# Altium project AMC_FMC_Carrier v4.PrjPcb (part 11 of 17)

## Sheet UI_mon.SchDoc: AMC FMC Carrier v4.0.5
size A4; CompanyName: WUT; Organization: WUT ISE; Address1: Warsaw University of Technology; Address2: Nowowiejska 15/19 00-665 Warsaw; Address3: t.przywozki@gmail.com; Revision: 1; SheetNumber: 16; SheetTotal: 29; Project: AMC FMC Carrier v4.0.5; ModifiedBy: F. Świtakowski; CreateDate: XX/XX/XXXX; CheckedDate: -; Title2: Power Measurement; DivGrp: ISE; Designer: T. Przywozki; ModifiedDate: -; ProjectName: ADC/DAC MEZZANINE
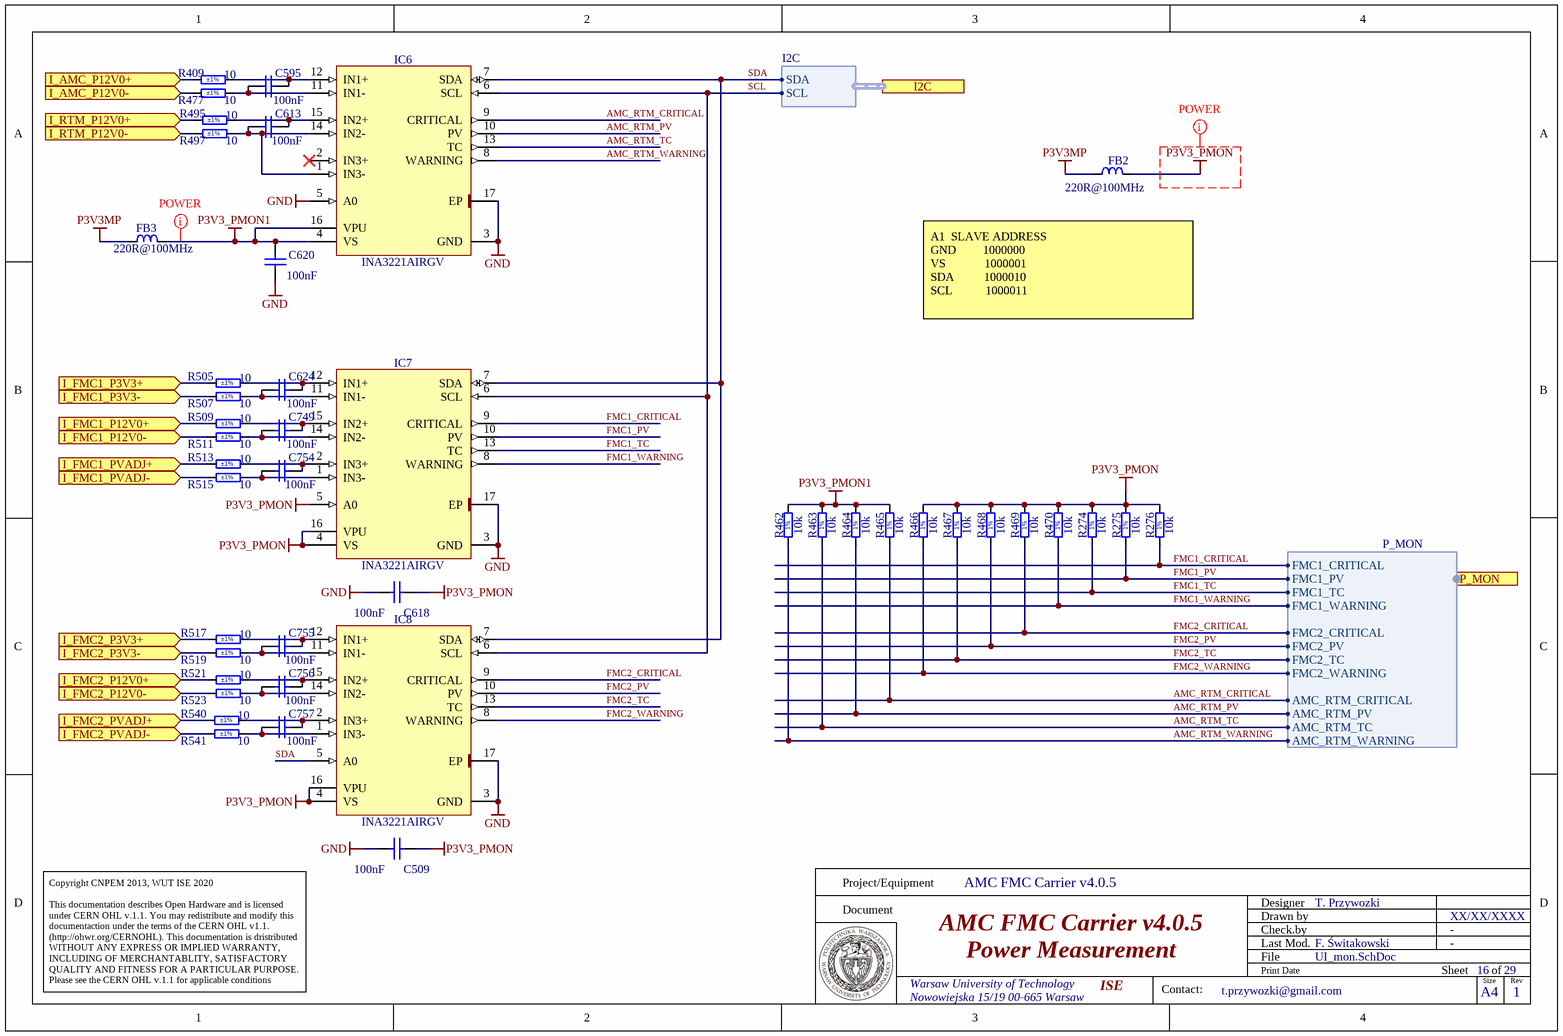
[diagram p19: UI_mon.SchDoc]

### Parts
C509  100nF  [CAPC0603X33N]
C595  100nF  [CAPC0603X33N]
C613  100nF  [CAPC0603X33N]
C618  100nF  [CAPC0603X33N]
C620  100nF  [CAPC0603X33N]
C624  100nF  [CAPC0603X33N]
C749  100nF  [CAPC0603X33N]
C754  100nF  [CAPC0603X33N]
C755  100nF  [CAPC0603X33N]
C756  100nF  [CAPC0603X33N]
C757  100nF  [CAPC0603X33N]
FB2  220R@100MHz  [INDC2012X105N]
FB3  220R@100MHz  [INDC2012X105N]
IC6  INA3221AIRGV  [QFN65P400X400X100-17N-S225]
IC7  INA3221AIRGV  [QFN65P400X400X100-17N-S225]
IC8  INA3221AIRGV  [QFN65P400X400X100-17N-S225]
R274  10k  [RESC1005X40N]
R275  10k  [RESC1005X40N]
R276  10k  [RESC1005X40N]
R409  10  Tolerance: ±1%  [RESC1005X40N]
R462  10k  [RESC1005X40N]
R463  10k  [RESC1005X40N]
R464  10k  [RESC1005X40N]
R465  10k  [RESC1005X40N]
R466  10k  [RESC1005X40N]
R467  10k  [RESC1005X40N]
R468  10k  [RESC1005X40N]
R469  10k  [RESC1005X40N]
R470  10k  [RESC1005X40N]
R477  10  Tolerance: ±1%  [RESC1005X40N]
R495  10  Tolerance: ±1%  [RESC1005X40N]
R497  10  Tolerance: ±1%  [RESC1005X40N]
R505  10  Tolerance: ±1%  [RESC1005X40N]
R507  10  Tolerance: ±1%  [RESC1005X40N]
R509  10  Tolerance: ±1%  [RESC1005X40N]
R511  10  Tolerance: ±1%  [RESC1005X40N]
R513  10  Tolerance: ±1%  [RESC1005X40N]
R515  10  Tolerance: ±1%  [RESC1005X40N]
R517  10  Tolerance: ±1%  [RESC1005X40N]
R519  10  Tolerance: ±1%  [RESC1005X40N]
R521  10  Tolerance: ±1%  [RESC1005X40N]
R523  10  Tolerance: ±1%  [RESC1005X40N]
R540  10  Tolerance: ±1%  [RESC1005X40N]
R541  10  Tolerance: ±1%  [RESC1005X40N]

### Ports
I2C (harness I2C), I_AMC_P12V0+ (in), I_AMC_P12V0- (in), I_FMC1_P3V3+ (in), I_FMC1_P3V3- (in), I_FMC1_P12V0+ (in), I_FMC1_P12V0- (in), I_FMC1_PVADJ+ (in), I_FMC1_PVADJ- (in), I_FMC2_P3V3+ (in), I_FMC2_P3V3- (in), I_FMC2_P12V0+ (in), I_FMC2_P12V0- (in), I_FMC2_PVADJ+ (in), I_FMC2_PVADJ- (in), I_RTM_P12V0+ (in), I_RTM_P12V0- (in), P_MON (harness P_MON)

### Harnesses
I2C: SCL, SDA
P_MON: FMC1_CRITICAL, FMC1_TC, FMC1_WARNING, AMC_RTM_CRITICAL, FMC2_WARNING, AMC_RTM_PV, FMC2_CRITICAL, AMC_RTM_TC, FMC2_PV, AMC_RTM_WARNING, FMC2_TC, FMC1_PV

### Nets
GND: C509.2 C618.2 C620.2 IC6.3(GND) IC6.5(A0) IC6.17(EP) IC7.3(GND) IC7.17(EP) IC8.3(GND) IC8.17(EP)
P3V3_PMON: C509.1 C618.1 FB2.2 IC7.4(VS) IC7.5(A0) IC7.16(VPU) IC8.4(VS) IC8.16(VPU) R274.2 R275.2 R276.2 R466.2 R467.2 R468.2 R469.2 R470.2
P3V3_PMON1: C620.1 FB3.2 IC6.4(VS) IC6.16(VPU) R462.2 R463.2 R464.2 R465.2
P3V3MP: FB2.1 FB3.1
AMC_RTM_CRITICAL: IC6.9(CRITICAL) R465.1 ; port P_MON.AMC_RTM_CRITICAL
AMC_RTM_PV: IC6.10(PV) R464.1 ; port P_MON.AMC_RTM_PV
AMC_RTM_TC: IC6.13(TC) R463.1 ; port P_MON.AMC_RTM_TC
AMC_RTM_WARNING: IC6.8(WARNING) R462.1 ; port P_MON.AMC_RTM_WARNING
FMC1_CRITICAL: IC7.9(CRITICAL) R276.1 ; port P_MON.FMC1_CRITICAL
FMC1_PV: IC7.10(PV) R275.1 ; port P_MON.FMC1_PV
FMC1_TC: IC7.13(TC) R274.1 ; port P_MON.FMC1_TC
FMC1_WARNING: IC7.8(WARNING) R470.1 ; port P_MON.FMC1_WARNING
FMC2_CRITICAL: IC8.9(CRITICAL) R469.1 ; port P_MON.FMC2_CRITICAL
FMC2_PV: IC8.10(PV) R468.1 ; port P_MON.FMC2_PV
FMC2_TC: IC8.13(TC) R467.1 ; port P_MON.FMC2_TC
FMC2_WARNING: IC8.8(WARNING) R466.1 ; port P_MON.FMC2_WARNING
I_AMC_P12V0+: R409.1 ; port I_AMC_P12V0+
I_AMC_P12V0-: R477.1 ; port I_AMC_P12V0-
I_FMC1_P3V3n: R507.1 ; port I_FMC1_P3V3-
I_FMC1_P3V3p: R505.1 ; port I_FMC1_P3V3+
I_FMC1_P12V0+: R509.1 ; port I_FMC1_P12V0+
I_FMC1_P12V0-: R511.1 ; port I_FMC1_P12V0-
I_FMC1_PADJn: R515.1 ; port I_FMC1_PVADJ-
I_FMC1_PADJp: R513.1 ; port I_FMC1_PVADJ+
I_FMC2_P3V3n: R519.1 ; port I_FMC2_P3V3-
I_FMC2_P3V3p: R517.1 ; port I_FMC2_P3V3+
I_FMC2_P12V0+: R521.1 ; port I_FMC2_P12V0+
I_FMC2_P12V0-: R523.1 ; port I_FMC2_P12V0-
I_FMC2_PADJn: R541.1 ; port I_FMC2_PVADJ-
I_FMC2_PADJp: R540.1 ; port I_FMC2_PVADJ+
I_RTM_P12V0+: R495.1 ; port I_RTM_P12V0+
I_RTM_P12V0-: R497.1 ; port I_RTM_P12V0-
SCL: IC6.6(SCL) IC7.6(SCL) IC8.6(SCL) ; port I2C.SCL  [project net PM_I2C.SCL]
SDA: IC6.7(SDA) IC7.7(SDA) IC8.5(A0) IC8.7(SDA) ; port I2C.SDA  [project net PM_I2C.SDA]
NetC595_1: C595.1 IC6.11(IN1-) R477.2
NetC595_2: C595.2 IC6.12(IN1+) R409.2
NetC613_1: C613.1 IC6.1(IN3-) IC6.14(IN2-) R497.2
NetC613_2: C613.2 IC6.15(IN2+) R495.2
NetC624_1: C624.1 IC7.11(IN1-) R507.2
NetC624_2: C624.2 IC7.12(IN1+) R505.2
NetC749_1: C749.1 IC7.14(IN2-) R511.2
NetC749_2: C749.2 IC7.15(IN2+) R509.2
NetC754_1: C754.1 IC7.1(IN3-) R515.2
NetC754_2: C754.2 IC7.2(IN3+) R513.2
NetC755_1: C755.1 IC8.11(IN1-) R519.2
NetC755_2: C755.2 IC8.12(IN1+) R517.2
NetC756_1: C756.1 IC8.14(IN2-) R523.2
NetC756_2: C756.2 IC8.15(IN2+) R521.2
NetC757_1: C757.1 IC8.1(IN3-) R541.2
NetC757_2: C757.2 IC8.2(IN3+) R540.2

Not connected (* = marked no-connect by the designer): IC6 2(IN3+)*

### Layout directives
net class POWER: P3V3_PMON, P3V3_PMON1

### Notes on the sheet
- (near FB2) A1 	SLAVE ADDRESS
  GND         1000000
  VS             1000001
  SDA          1000010
  SCL           1000011
- Project/Equipment
- Document
- Designer
- Drawn by
- Check.by
- Copyright CNPEM 2013, WUT ISE 2020
  This documentation describes Open Hardware and is licensed under CERN OHL v.1.1. You may redistribute and modify this documentaction under the terms of the CERN OHL v1.1.
  (http://ohwr.org/CERNOHL). This documentation is dristributed WITHOUT ANY EXPRESS OR IMPLIED WARRANTY, INCLUDING OF MERCHANTABLITY, SATISFACTORY QUALITY AND FITNESS FOR A PARTICULAR PURPOSE. Please see the CERN OHL v.1.1 for applicable conditions
- File
- Last Mod.
- Print Date
- Sheet
- Size
- A4
- of
- Rev
- Contact:
- (in symbol R0402_10K_1%_0.0625W_100PPM) 1%

### Library data of the parts
C509 C618 C620 = CC0201_100NF_6.3V_10%_X5R: Non-polarised capacitor; Part Description: SMD Multilayer Chip Ceramic Capacitor; Manufacturer: GENERIC; Manufacturer1 Part Number: 02016D104KAT2A; Voltage: 6.3V; TC: X5R; Tolerance: ±10%; Table: Capacitors SMD; Part Number: CC0201_100NF_6.3V_10%_X5R; Component Kind: Standard; Component Type: Standard; Pin Count: 2; Value: 100nF; Status: Not Recommended; Manufacturer Part Number: CC0201_100NF_6.3V_10%_X5R; Case: 0201; Mounted: Yes; Socket: No; SMD: Yes; Manufacturer1 Example: AVX; Manufacturer1 ComponentHeight: 0.33mm; HelpURL: \\cern.ch\dfs\Applications\Altium\Datasheets\CC0201_X5R_AVX.pdf; Author: CERN DEM JLC; CreateDate: 2007-12-03; LatestRevisionDate: 2007-12-03
C595 C613 C624 C749 C754-C757 = CC0201_100NF_6.3V_10%_X5R: Non-polarised capacitor; Part Description: SMD Multilayer Chip Ceramic Capacitor; Manufacturer: GENERIC; Manufacturer1 Part Number: 02016D104KAT2A; Voltage: 6.3V; TC: X5R; Tolerance: ±10%; Part Number: CC0201_100NF_6.3V_10%_X5R; Component Kind: Standard; Component Type: Standard; Pin Count: 2; Value: 100nF; Status: Not Recommended; Manufacturer Part Number: CC0201_100NF_6.3V_10%_X5R; Case: 0201; Mounted: Yes; Socket: No; SMD: Yes; Sense: No; Manufacturer1 Example: AVX; Manufacturer1 ComponentHeight: 0.33mm; HelpURL: \\cern.ch\dfs\Applications\Altium\Datasheets\CC0201_X5R_AVX.pdf; Author: CERN DEM JLC; CreateDate: 03.12.2007; LatestRevisionDate: 03.12.2007
FB2 FB3 = IND0805_MURATA_BLM21PG221SN1D: Inductor; Part Description: SMD EMIFIL Suppression Chip Bead Ferrite; Manufacturer: MURATA; Power: 2A; Resistance: 0.05R; Tolerance: ±25%; Table: Inductors SMD; Part Number: IND0805_MURATA_BLM21PG221SN1D; Component Kind: Standard; Component Type: Standard; Pin Count: 2; Value: 220R@100MHz; Status: None; Manufacturer Part Number: BLM21PG221SN1D; Case: 0805; Mounted: Yes; Socket: No; SMD: Yes; ComponentHeight: 1.05mm; HelpURL: \\cern.ch\dfs\Applications\Altium\Datasheets\IND0402_MURATA_BLM21P.pdf; Author: CERN DEM JLC; CreateDate: 25/01/2010; LatestRevisionDate: 25/01/2010
IC6-IC8 = INA3221AIRGV: Triple-Channel, High-Side Measurement, Shunt and Bus Voltage Monitor With I2C and SMBUS-Compatible Interface; Manufacturer: TEXAS INSTRUMENTS; PressFit: No; Bonding: No; Part Number: INA3221AIRGV; Component Kind: Standard; Component Type: Standard; Device: INA3221AIRGV; PackageDescription: QFN, 0.65mm Pitch, Square; 16 Pin, 4.00mm L X 4.00mm W X 1.00mm H body (w/Thermal Tab 2.25 X 2.25mm), IPC Medium Density; Part Description: Triple-Channel, High-Side Measurement, Shunt and Bus Voltage Monitor With I2C and SMBUS-Compatible Interface; Manufacturer Part Number: INA3221AIRGV; Pin Count: 17; Case: QFN16; Mounted: Yes; Socket: No; SMD: Yes; Sense: No; ComponentHeight: 1mm; Author: CERN DEM MR; HelpURL: \\cern.ch\dfs\Applications\Altium\Datasheets\INA3221AIRGV.pdf; CreateDate: 01.12.2016; LatestRevisionDate: 01.12.2016
R274-R276 R462-R470 = R0402_10K_1%_0.0625W_100PPM: Resistor - 1%; Manufacturer: GENERIC; Part Description: General Purpose Thick Film Chip Resistor; Manufacturer1 Part Number: 232270671003L; TC: ±100ppm/°C; PressFit: No; Manufacturer Part Number: R0402_10K_1%_0.0625W_100PPM; Part Number: R0402_10K_1%_0.0625W_100PPM; Tolerance: ±1%; Value: 10k; Component Kind: Standard; Component Type: Standard; Pin Count: 2; Status: Not Recommended; Power: 0.0625W; Case: 0402; Mounted: Yes; Sense: No; Socket: No; SMD: Yes; Manufacturer1 Example: YAGEO PHYCOMP; Manufacturer1 ComponentHeight: 0.4mm; HelpURL: \\cern.ch\dfs\Applications\Altium\Datasheets\R0402_Phycomp_RC0402.pdf; Author: CERN DEM JLC; CreateDate: 03.12.2007; LatestRevisionDate: 17.10.2012
R409 R477 R495 R497 R505 R507 R509 R511 R513 R515 R517 R519 R521 R523 R540 R541 = R0402_10R_1%_0.0625W_200PPM: Resistor - 1%; Part Description: General Purpose Thick Film Chip Resistor; Manufacturer: GENERIC; Manufacturer1 Part Number: 232270671009L; TC: ±200ppm/°C; PressFit: No; Part Number: R0402_10R_1%_0.0625W_200PPM; Component Kind: Standard; Component Type: Standard; Pin Count: 2; Value: 10; Status: Not Recommended; Power: 0.0625W; Manufacturer Part Number: R0402_10R_1%_0.0625W_200PPM; Case: 0402; Mounted: Yes; Sense: No; Socket: No; SMD: Yes; Manufacturer1 Example: YAGEO PHYCOMP; Manufacturer1 ComponentHeight: 0.4mm; HelpURL: \\cern.ch\dfs\Applications\Altium\Datasheets\R0402_Phycomp_RC0402.pdf; Author: CERN DEM JLC; CreateDate: 24.06.2009; LatestRevisionDate: 17.10.2012

## Sheet JTAG_Configuration.SchDoc: AMC FMC Carrier v4
size 420 x 297 mm; CompanyName: WUT; Organization: WUT ISE; Address1: Warsaw University of Technology; Address2: Nowowiejska 15/19 00-665 Warsaw; Address3: t.przywozki@gmail.com; Revision: 1; SheetNumber: 9; SheetTotal: 29; Project: AMC FMC Carrier v4.0.2; ModifiedBy: F. Świtakowski; CheckedDate: -; Title2: JTAG Chain; DivGrp: ISE; Designer: T. Przywozki; ModifiedDate: -; ProjectName: ADC/DAC MEZZANINE
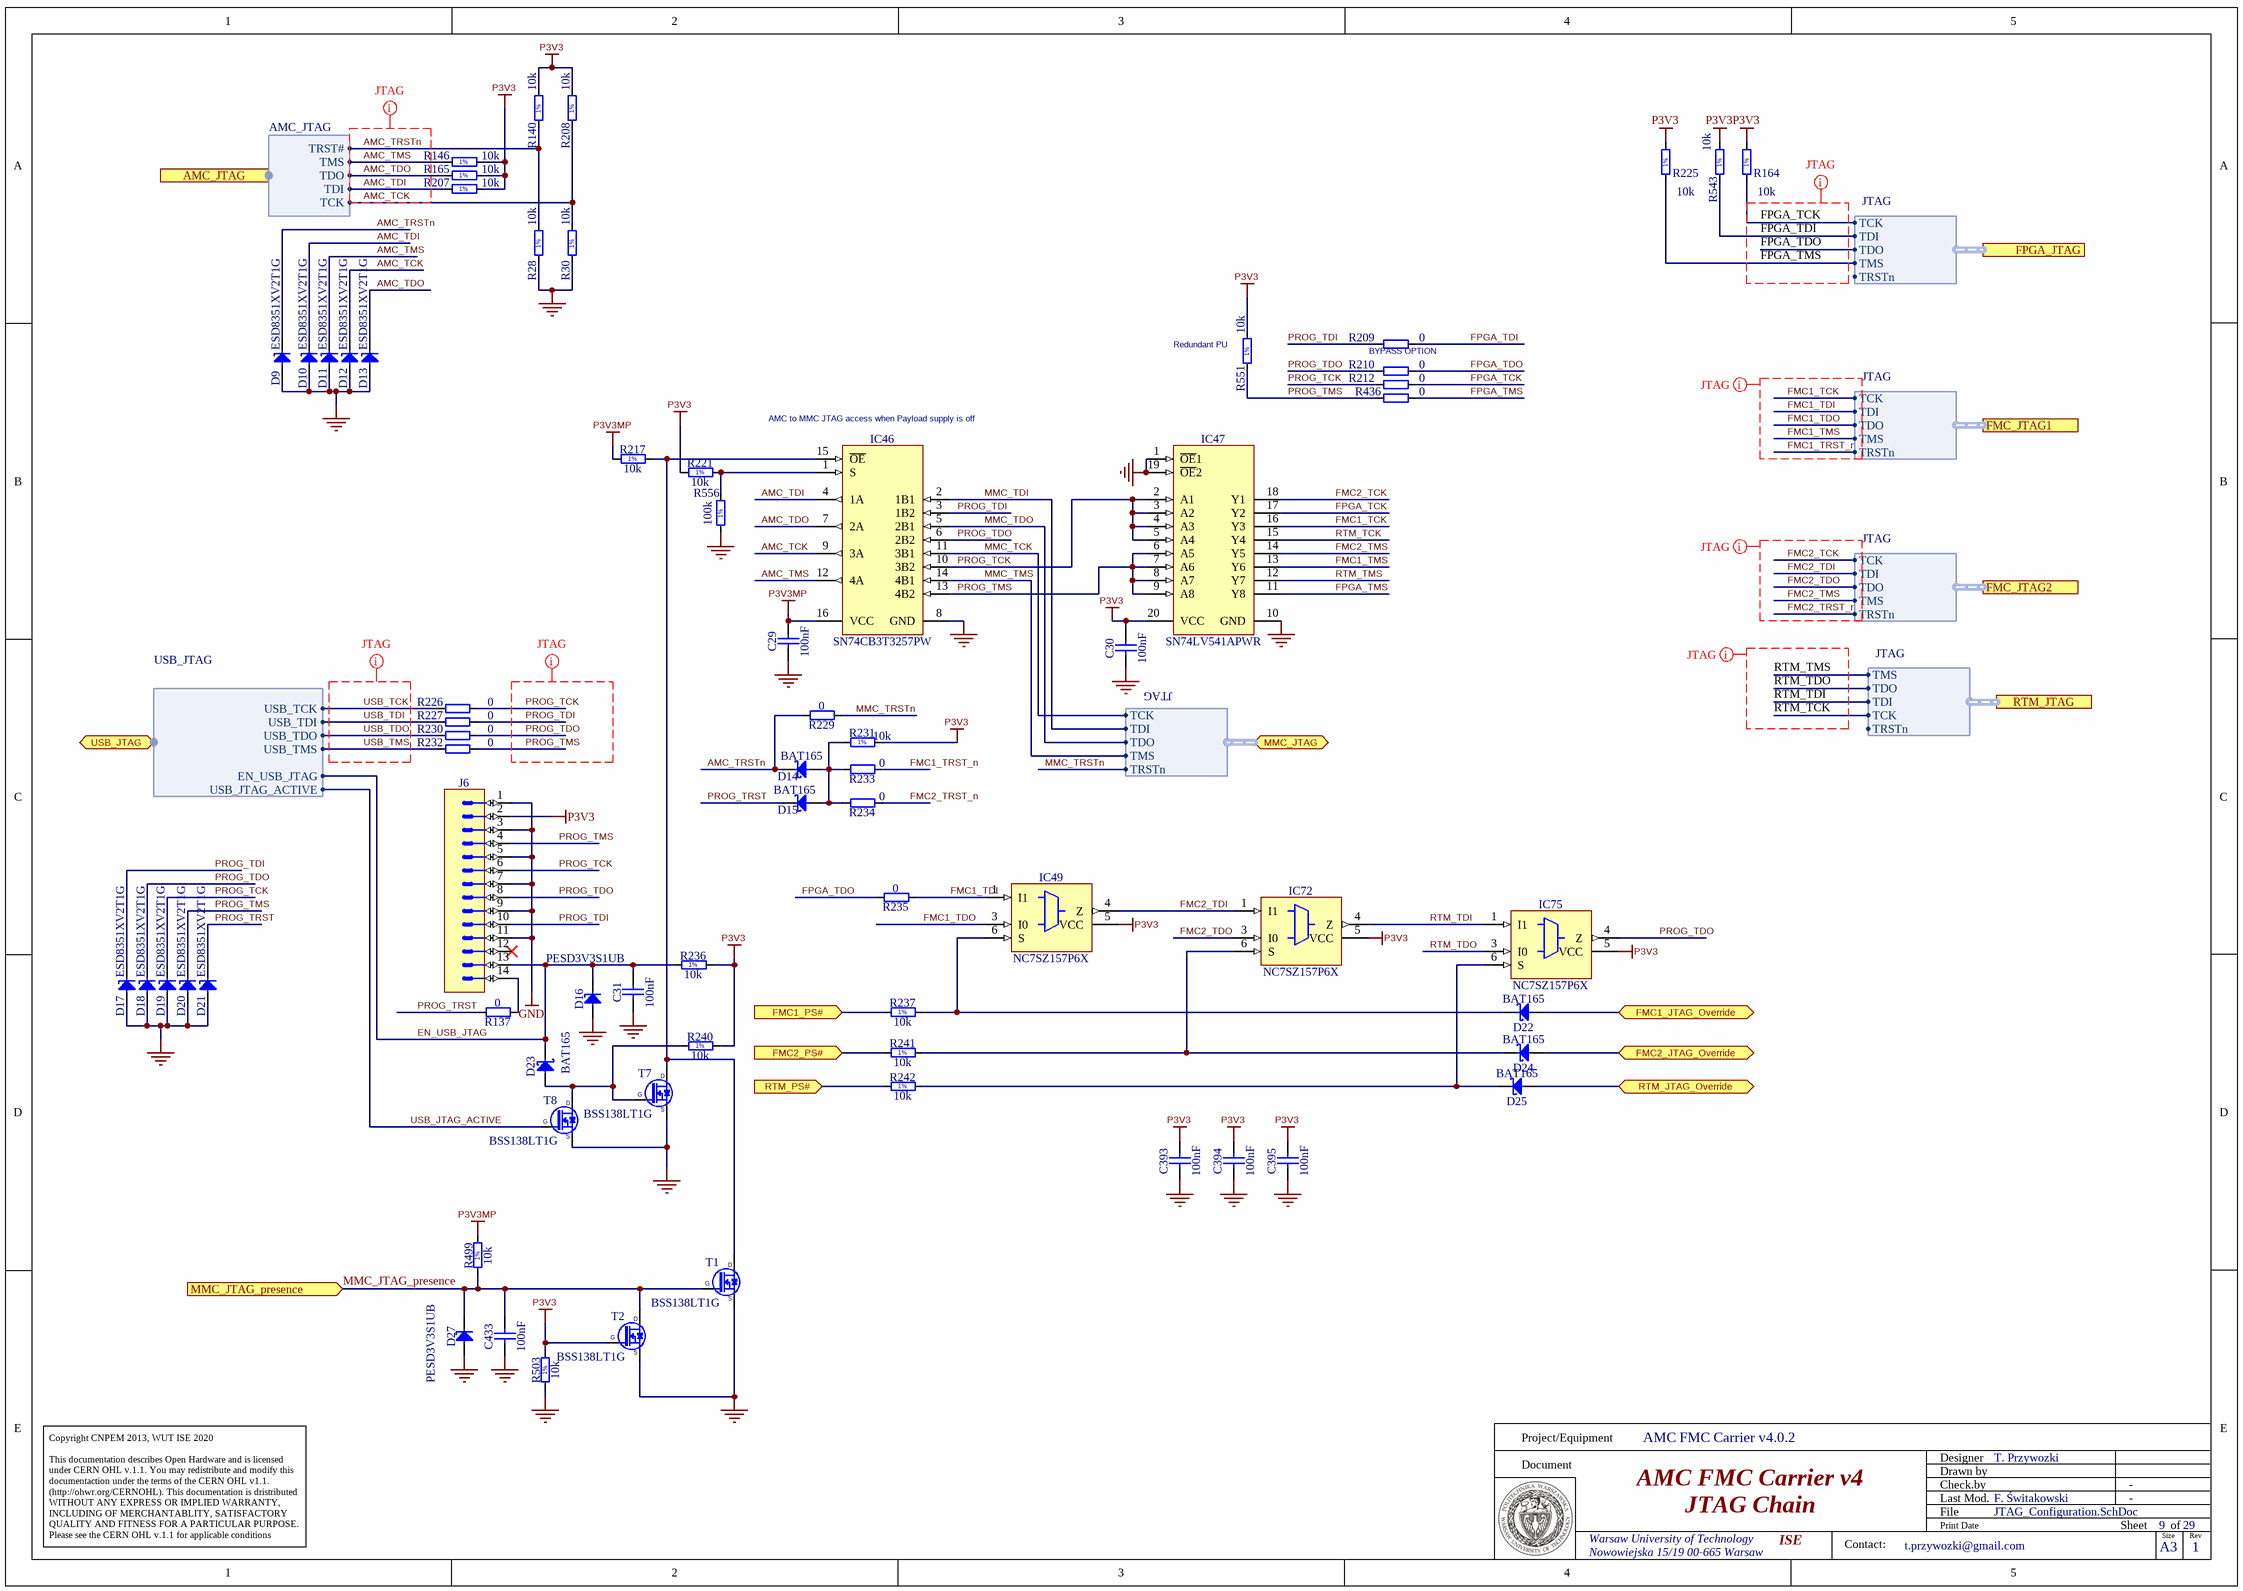
[diagram p20: JTAG_Configuration.SchDoc]

### Parts
C29  100nF  [CAPC0603X33N]
C30  100nF  [CAPC0603X33N]
C31  100nF  [CAPC1005X55N]
C393  100nF  [CAPC0603X33N]
C394  100nF  [CAPC0603X33N]
C395  100nF  [CAPC0603X33N]
C433  100nF  [CAPC1005X55N]
D9  ESD8351XV2T1G  [SODFL1608X65N]
D10  ESD8351XV2T1G  [SODFL1608X65N]
D11  ESD8351XV2T1G  [SODFL1608X65N]
D12  ESD8351XV2T1G  [SODFL1608X65N]
D13  ESD8351XV2T1G  [SODFL1608X65N]
D14  BAT165  [SOD2512X110N]
D15  BAT165  [SOD2512X110N]
D16  PESD3V3S1UB  [SODFL1608X65N]
D17  ESD8351XV2T1G  [SODFL1608X65N]
D18  ESD8351XV2T1G  [SODFL1608X65N]
D19  ESD8351XV2T1G  [SODFL1608X65N]
D20  ESD8351XV2T1G  [SODFL1608X65N]
D21  ESD8351XV2T1G  [SODFL1608X65N]
D22  BAT165  [SOD2512X110N]
D23  BAT165  [SOD2512X110N]
D24  BAT165  [SOD2512X110N]
D25  BAT165  [SOD2512X110N]
D27  PESD3V3S1UB  [SODFL1608X65N]
IC46  SN74CB3T3257PW  [SOP65P640X120-16N]
IC47  SN74LV541APWR  [SOP65P640X120-20N]
IC49  NC7SZ157P6X  [SOT65P210X110-6N]
IC72  NC7SZ157P6X  [SOT65P210X110-6N]
IC75  NC7SZ157P6X  [SOT65P210X110-6N]
J6  Milli-Grid™  [MOLEX_87832-1420]  (value not drawn)
R28  10k  [RESC1005X40N]
R30  10k  [RESC1005X40N]
R137  0  [RESC1005X40N]
R140  10k  [RESC1005X40N]
R146  10k  [RESC1005X40N]
R164  10k  [RESC1005X40N]
R165  10k  [RESC1005X40N]
R207  10k  [RESC1005X40N]
R208  10k  [RESC1005X40N]
R209  0  [RESC1005X40N]
R210  0  [RESC1005X40N]
R212  0  [RESC1005X40N]
R217  10k  [RESC1005X40N]
R221  10k  [RESC1005X40N]
R225  10k  [RESC1005X40N]
R226  0  [RESC1005X40N]
R227  0  [RESC1005X40N]
R229  0  [RESC1005X40N]
R230  0  [RESC1005X40N]
R231  10k  [RESC1005X40N]
R232  0  [RESC1005X40N]
R233  0  [RESC1005X40N]
R234  0  [RESC1005X40N]
R235  0  [RESC1005X40N]
R236  10k  [RESC1005X40N]
R237  10k  [RESC1005X40N]
R240  10k  [RESC1005X40N]
R241  10k  [RESC1005X40N]
R242  10k  [RESC1005X40N]
R436  0  [RESC1005X40N]
R499  10k  [RESC1005X40N]
R503  10k  [RESC1005X40N]
R543  10k  [RESC1005X40N]
R551  10k  [RESC1005X40N]
R556  100k  [RESC1005X40N]
T1  BSS138LT1G  [SOT95P240X110-3N]
T2  BSS138LT1G  [SOT95P240X110-3N]
T7  BSS138LT1G  [SOT95P240X110-3N]
T8  BSS138LT1G  [SOT95P240X110-3N]

### Ports
AMC_JTAG (harness AMC_JTAG), FMC1_JTAG_Override (bidir), FMC1_PS# (in), FMC2_JTAG_Override (bidir), FMC2_PS# (in), FMC_JTAG1 (harness JTAG), FMC_JTAG2 (harness JTAG), FPGA_JTAG (harness JTAG), MMC_JTAG (bidir, harness JTAG), MMC_JTAG_presence (in), RTM_JTAG (harness JTAG), RTM_JTAG_Override (bidir), RTM_PS# (in), USB_JTAG (bidir, harness USB_JTAG)

### Harnesses
AMC_JTAG: TCK, TDI, TDO, TMS, TRST#
USB_JTAG: USB_TDI, USB_TCK, USB_TMS, USB_TDO, USB_JTAG_ACTIVE, EN_USB_JTAG
JTAG: TCK, TDI, TDO, TMS, TRSTn

### Nets
GND: C29.1 C30.1 C31.1 C393.1 C394.1 C395.1 C433.1 D9.2(A) D10.2(A) D11.2(A) D12.2(A) D13.2(A) D16.2(A) D17.2(A) D18.2(A) D19.2(A) D20.2(A) D21.2(A) D27.2(A) IC46.8(GND) IC47.1(~{OE}1) IC47.10(GND) IC47.19(~{OE}2) IC49.2(GND) IC72.2(GND) IC75.2(GND) J6.1 J6.3 J6.5 J6.7 J6.9 J6.11 R28.2 R30.2 R503.1 R556.1 T1.2(S) T2.2(S) T7.2(S) T8.2(S)
P3V3: C30.2 C393.2 C394.2 C395.2 IC47.20(VCC) IC49.5(VCC) IC72.5(VCC) IC75.5(VCC) J6.2 R140.1 R146.1 R164.2 R165.1 R207.1 R208.1 R221.2 R225.2 R231.1 R236.2 R240.2 R503.2 R543.1 R551.1 T2.1(G)
P3V3MP: C29.2 IC46.16(VCC) R217.2 R499.2
AMC_TCK: D12.1(C) IC46.9(3A) R30.1 R208.2 ; port AMC_JTAG.TCK  [project net AJTAG.TCK]
AMC_TDI: D10.1(C) IC46.4(1A) R207.2 ; port AMC_JTAG.TDI  [project net AJTAG.TDI]
AMC_TDO: D13.1(C) IC46.7(2A) R165.2 ; port AMC_JTAG.TDO  [project net AJTAG.TDO]
AMC_TMS: D11.1(C) IC46.12(4A) R146.2 ; port AMC_JTAG.TMS  [project net AJTAG.TMS]
AMC_TRSTn: D9.1(C) D14.1(C) R28.1 R140.2 R229.2 ; port AMC_JTAG.TRST#  [project net AJTAG.TRST#]
EN_USB_JTAG: C31.2 D16.1(C) D23.1(C) J6.13 R236.1 ; port USB_JTAG.EN_USB_JTAG
FMC1_JTAG_Override: D22.2(A) ; port FMC1_JTAG_Override
FMC1_TCK: IC47.16(Y3) ; port FMC_JTAG1.TCK  [project net JTAG1.TCK]
FMC1_TDI: IC49.1(I1) R235.1 ; port FMC_JTAG1.TDI  [project net JTAG1.TDI]
FMC1_TDO: IC49.3(I0) ; port FMC_JTAG1.TDO  [project net JTAG1.TDO]
FMC1_TMS: IC47.13(Y6) ; port FMC_JTAG1.TMS  [project net JTAG1.TMS]
FMC1_TRST_n: R233.1 ; port FMC_JTAG1.TRSTn  [project net JTAG1.TRSTn]
FMC2_JTAG_Override: D24.2(A) ; port FMC2_JTAG_Override
FMC2_TCK: IC47.18(Y1) ; port FMC_JTAG2.TCK  [project net JTAG2.TCK]
FMC2_TDI: IC49.4(Z) IC72.1(I1) ; port FMC_JTAG2.TDI  [project net JTAG2.TDI]
FMC2_TDO: IC72.3(I0) ; port FMC_JTAG2.TDO  [project net JTAG2.TDO]
FMC2_TMS: IC47.14(Y5) ; port FMC_JTAG2.TMS  [project net JTAG2.TMS]
FMC2_TRST_n: R234.1 ; port FMC_JTAG2.TRSTn  [project net JTAG2.TRSTn]
FMC_PRSNT.FMC1_PRSNT_M2C_L: R237.2 ; port FMC1_PS#
FMC_PRSNT.FMC2_PRSNT_M2C_L: R241.2 ; port FMC2_PS#
FPGA_TCK: IC47.17(Y2) R164.1 R212.1 ; port FPGA_JTAG.TCK  [project net FJTAG.TCK]
FPGA_TDI: R209.1 R543.2 ; port FPGA_JTAG.TDI  [project net FJTAG.TDI]
FPGA_TDO: R210.1 R235.2 ; port FPGA_JTAG.TDO  [project net FJTAG.TDO]
FPGA_TMS: IC47.11(Y8) R225.1 R436.1 ; port FPGA_JTAG.TMS  [project net FJTAG.TMS]
MMC_JTAG_presence: C433.2 D27.1(C) R499.1 T1.1(G) T2.3(D) ; port MMC_JTAG_presence
MMC_TCK: IC46.11(3B1) ; port MMC_JTAG.TCK
MMC_TDI: IC46.2(1B1) ; port MMC_JTAG.TDI
MMC_TDO: IC46.5(2B1) ; port MMC_JTAG.TDO
MMC_TMS: IC46.14(4B1) ; port MMC_JTAG.TMS
MMC_TRSTn: R229.1 ; port MMC_JTAG.TRSTn
PROG_TCK: D19.1(C) IC46.10(3B2) IC47.2(A1) IC47.3(A2) IC47.4(A3) IC47.5(A4) J6.6 R212.2 R226.1
PROG_TDI: D17.1(C) IC46.3(1B2) J6.10 R209.2 R227.1
PROG_TDO: D18.1(C) IC46.6(2B2) IC75.4(Z) J6.8 R210.2 R230.1
PROG_TMS: D20.1(C) IC46.13(4B2) IC47.6(A5) IC47.7(A6) IC47.8(A7) IC47.9(A8) J6.4 R232.1 R436.2 R551.2
PROG_TRST: D15.1(C) D21.1(C) R137.2
RTM_JTAG_Override: D25.2(A) ; port RTM_JTAG_Override
RTM_PS#: R242.2 ; port RTM_PS#
RTM_TCK: IC47.15(Y4) ; port RTM_JTAG.TCK
RTM_TDI: IC72.4(Z) IC75.1(I1) ; port RTM_JTAG.TDI
RTM_TDO: IC75.3(I0) ; port RTM_JTAG.TDO
RTM_TMS: IC47.12(Y7) ; port RTM_JTAG.TMS
USB_JTAG_ACTIVE: T8.1(G) ; port USB_JTAG.USB_JTAG_ACTIVE
USB_TCK: R226.2 ; port USB_JTAG.USB_TCK
USB_TDI: R227.2 ; port USB_JTAG.USB_TDI
USB_TDO: R230.2 ; port USB_JTAG.USB_TDO
USB_TMS: R232.2 ; port USB_JTAG.USB_TMS
NetD14_2: D14.2(A) D15.2(A) R231.2 R233.2 R234.2
NetD22_1: D22.1(C) IC49.6(S) R237.1
NetD23_2: D23.2(A) R240.1 T7.1(G) T8.3(D)
NetD24_1: D24.1(C) IC72.6(S) R241.1
NetD25_1: D25.1(C) IC75.6(S) R242.1
NetIC46_1: IC46.1(S) R221.1 R556.2
NetIC46_15: IC46.15(~{OE}) R217.1 T1.3(D) T7.3(D)
NetJ6_14: J6.14 R137.1

Not connected (* = marked no-connect by the designer): J6 12*

### Layout directives
net class JTAG: AMC_TCK, AMC_TDI, AMC_TDO, AMC_TMS, AMC_TRSTn, FMC1_TCK, FMC1_TDI, FMC1_TDO, FMC1_TMS, FMC1_TRST_n, FMC2_TCK, FMC2_TDI, FMC2_TDO, FMC2_TMS, FMC2_TRST_n, FPGA_TCK, FPGA_TDI, FPGA_TDO, FPGA_TMS, PROG_TCK, PROG_TDI, PROG_TDO, PROG_TMS, RTM_TCK, RTM_TDI, RTM_TDO, RTM_TMS, USB_TCK, USB_TDI, USB_TDO, USB_TMS

### Notes on the sheet
- (near R551) Redundant PU
- (near R209) BYPASS OPTION
- (near IC46) AMC to MMC JTAG access when Payload supply is off
- Project/Equipment
- Document
- Designer
- Drawn by
- Check.by
- Copyright CNPEM 2013, WUT ISE 2020
  This documentation describes Open Hardware and is licensed under CERN OHL v.1.1. You may redistribute and modify this documentaction under the terms of the CERN OHL v1.1.
  (http://ohwr.org/CERNOHL). This documentation is dristributed WITHOUT ANY EXPRESS OR IMPLIED WARRANTY, INCLUDING OF MERCHANTABLITY, SATISFACTORY QUALITY AND FITNESS FOR A PARTICULAR PURPOSE. Please see the CERN OHL v.1.1 for applicable conditions
- File
- Last Mod.
- Print Date
- Sheet
- Size
- A3
- of
- Rev
- Contact:
- (in symbol R0402_10K_1%_0.0625W_100PPM) 1%
- (in symbol R0402_100K_1%_0.0625W_100PPM) 1%

### Library data of the parts
C29 C30 C393-C395 = CC0201_100NF_6.3V_10%_X5R: Non-polarised capacitor; Manufacturer: GENERIC; Part Description: SMD Multilayer Chip Ceramic Capacitor; Manufacturer1 Part Number: 02016D104KAT2A; Tolerance: ±10%; Voltage: 6.3V; TC: X5R; Manufacturer Part Number: CC0201_100NF_6.3V_10%_X5R; Part Number: CC0201_100NF_6.3V_10%_X5R; Value: 100nF; Component Kind: Standard; Component Type: Standard; Pin Count: 2; Status: Not Recommended; Case: 0201; Mounted: Yes; Socket: No; SMD: Yes; Sense: No; Manufacturer1 Example: AVX; Manufacturer1 ComponentHeight: 0.33mm; HelpURL: \\cern.ch\dfs\Applications\Altium\Datasheets\CC0201_X5R_AVX.pdf; Author: CERN DEM JLC; CreateDate: 03.12.2007; LatestRevisionDate: 03.12.2007
C31 C433 = CC0402_100NF_16V_10%_X5R: Non-polarised capacitor; Manufacturer: GENERIC; Part Description: SMD Multilayer Chip Ceramic Capacitor; Manufacturer1 Part Number: GRM155R61C104KA88D; Tolerance: ±10%; Voltage: 16V; TC: X5R; Manufacturer Part Number: CC0402_100NF_16V_10%_X5R; Part Number: CC0402_100NF_16V_10%_X5R; Value: 100nF; Component Kind: Standard; Component Type: Standard; Pin Count: 2; Status: None; Case: 0402; Mounted: Yes; Socket: No; SMD: Yes; Sense: No; Manufacturer1 Example: MURATA; Manufacturer1 ComponentHeight: 0.55mm; HelpURL: \\cern.ch\dfs\Applications\Altium\Datasheets\CC0402_X5R_MURATA_GRM.pdf; Author: CERN DEM JLC; CreateDate: 10.12.2013; LatestRevisionDate: 10.12.2013
D9-D13 D16-D21 D27 = PESD3V3S1UB: ESD protection diode; Manufacturer: NXP SEMICONDUCTORS; Part Description: ESD protection diode (23kV); Voltage: 3V3; Power: 330W; PressFit: No; Bonding: No; PackageDescription: Ultra Small Outline Diode Flat Lead (SOD-523), Body; 1.2mm L X 0.8mm W X 0.65mm H, IPC Medium Density; Component Kind: Standard; Component Type: Standard; Pin Count: 2; Case: SOD523; Mounted: Yes; Socket: No; SMD: Yes; Sense: No; ComponentHeight: 0.65mm; HelpURL: \\cern.ch\dfs\Applications\Altium\Datasheets\PESD3V3S1UB.pdf; Author: CERN DEM JLC; CreateDate: 29.11.2012; LatestRevisionDate: 29.11.2012
  D9-D13 D17-D21: Manufacturer Part Number: ESD8351XV2T1G; Part Number: ESD8351XV2T1G; Device: ESD8351XV2T1G
  D16 D27: Manufacturer Part Number: PESD3V3S1UB; Part Number: PESD3V3S1UB; Device: PESD3V3S1UB
D14 D15 D22-D25 = BAT165: Schottky Diode; Manufacturer: INFINEON; Part Description: Medium Power AF Schottky Diode; Voltage: 40V; Power: 750mA; PressFit: No; Bonding: No; Manufacturer Part Number: BAT165; PackageDescription: Small Outline Diode (SOD-323), 1.70mm W X 1.25mm L X 1.10mm H body,  IPC Medium Density; Part Number: BAT165; Component Kind: Standard; Component Type: Standard; Device: BAT165; Pin Count: 2; Case: SOD323; Mounted: Yes; Socket: No; SMD: Yes; Sense: No; ComponentHeight: 1.1mm; HelpURL: \\cern.ch\dfs\Applications\Altium\Datasheets\BAT165.pdf; Author: CERN DEM JLC; CreateDate: 12.11.2014; LatestRevisionDate: 12.11.2014
IC46 = SN74CB3T3257PW: 4-BIT 1-OF-2 FET Multiplexer/Demultiplexer 2.5V/3.3V Low-Voltage Bus Switch 5V Tolerant Shifter; Manufacturer: TEXAS INSTRUMENTS; PressFit: No; Bonding: No; Manufacturer Part Number: SN74CB3T3257PW; PackageDescription: SOP, 0.65mm pitch; 16 pin, 4.40mm W X 5.00mm L X 1.20mm H body IPC Medium Density; Part Description: 4-Bit 1-of-2 FET Multiplexer/Demultiplexer 2.5V/3.3V Low-Voltage Bus Switch 5V Tolerant Shifter; Part Number: SN74CB3T3257PW; Component Kind: Standard; Component Type: Standard; Device: SN74CB3T3257PW; Pin Count: 16; Case: TSSOP16; Mounted: Yes; Socket: No; SMD: Yes; Sense: No; ComponentHeight: 1.2mm; Author: CERN DEM JLC; HelpURL: \\cern.ch\dfs\Applications\Altium\Datasheets\SN74CB3T3257PW.pdf; CreateDate: 30.01.2012; LatestRevisionDate: 30.01.2012
IC47 = SN74LV541APWR: Octal Buffer/Line Driver with 3-State Outputs; Manufacturer: TEXAS INSTRUMENTS; Part Description: Octal Bus Transceiver/Driver with 3-State Outputs; PressFit: No; Bonding: No; Manufacturer Part Number: SN74LV541APWR; PackageDescription: SOP, 20-Leads, Body 6.5x4.4mm, Pitch 0.65mm, IPC Medium Density; Part Number: SN74LV541APWR; Component Kind: Standard; Component Type: Standard; Device: SN74LV541APWR; Pin Count: 20; Case: TSSOP20; Mounted: Yes; Socket: No; SMD: Yes; Sense: No; ComponentHeight: 1.2mm; Author: CERN DEM JLC; HelpURL: \\cern.ch\dfs\Applications\Altium\Datasheets\SN74LV541APWR.pdf; CreateDate: 07.07.2014; LatestRevisionDate: 07.07.2014
IC49 IC72 IC75 = NC7SZ157P6X: TinyLogic® UHS 2-Input Non-Inverting Multiplexer; Manufacturer: FAIRCHILD SEMICONDUCTOR; PressFit: No; Bonding: No; Manufacturer Part Number: NC7SZ157P6X; PackageDescription: SOT363, 0.65mm pitch; 6 pin, 1.40mm W X 2.15mm L, IPC Medium Density; Part Description: TinyLogic® UHS 2-Input Non-Inverting Multiplexer; Part Number: NC7SZ157P6X; Component Kind: Standard; Component Type: Standard; Device: NC7SZ157P6X; Pin Count: 6; Case: SOT363; Mounted: Yes; Socket: No; SMD: Yes; Sense: No; ComponentHeight: 1.1mm; Author: CERN DEM JLC; HelpURL: \\cern.ch\dfs\Applications\Altium\Datasheets\NC7SZ157P6X.pdf; CreateDate: 22.03.2012; LatestRevisionDate: 22.03.2012
J6 = MOLEX_87832-1420: Connector 14 Male; Part Description: 2.00mm (.079") Pitch Milli-Grid™ Header, Surface Mount, Vertical, Shrouded, 14 Circuits,with Locking Windows and Centre Polarization Slot, PCB Locator; Manufacturer: MOLEX; Part Number: MOLEX_87832-1420; Component Kind: Standard; Component Type: Standard; Pin Count: 14; Family: Milli-Grid™; Mounted: Yes; Socket: No; SMD: Yes; Status: None; Manufacturer Part Number: 87832-1420; ComponentHeight: 6.4mm; HelpURL: \\cern.ch\dfs\Applications\Altium\Datasheets\MOLEX_87832-1420.pdf; Author: CERN DEM JLC; CreateDate: 2008-09-09; LatestRevisionDate: 2008-09-09; Table: MOLEX
R28 R30 R140 R146 R165 R207 R208 R217 R221 R231 R236 R237 R240-R242 R499 R503 R543 R551 = R0402_10K_1%_0.0625W_100PPM: as R274-R276 on sheet UI_mon; Manufacturer Part Number: R0402_10K_1%_0.0625W_100PPM; Part Number: R0402_10K_1%_0.0625W_100PPM; Tolerance: ±1%; Value: 10k; Component Kind: Standard; Component Type: Standard; Pin Count: 2; Status: Not Recommended; Power: 0.0625W; Case: 0402; Mounted: Yes; Sense: No; Socket: No; SMD: Yes; Manufacturer1 Example: YAGEO PHYCOMP; Manufacturer1 ComponentHeight: 0.4mm; HelpURL: \\cern.ch\dfs\Applications\Altium\Datasheets\R0402_Phycomp_RC0402.pdf; Author: CERN DEM JLC; CreateDate: 03.12.2007; LatestRevisionDate: 17.10.2012
R137 R209 R210 R212 R226 R227 R229 R230 R232-R235 R436 = R0402_0R_JUMPER: Resistor; Manufacturer: GENERIC; Part Description: 1A (0.05R Max DC Resistance) Zero Ohm Jumper; Manufacturer1 Part Number: 232270591001L; PressFit: No; Manufacturer Part Number: R0402_0R_JUMPER; Part Number: R0402_0R_JUMPER; Value: 0; Component Kind: Standard; Component Type: Standard; Pin Count: 2; Status: Not Recommended; Case: 0402; Mounted: Yes; Sense: No; Socket: No; SMD: Yes; Manufacturer1 Example: YAGEO PHYCOMP; Manufacturer1 ComponentHeight: 0.4mm; HelpURL: \\cern.ch\dfs\Applications\Altium\Datasheets\R0402_Phycomp_RC0402.pdf; Author: CERN DEM JLC; CreateDate: 03.12.2007; LatestRevisionDate: 17.10.2012
R164 R225 = R0402_10K_1%_0.0625W_100PPM: Resistor - 1%; Part Description: General Purpose Thick Film Chip Resistor; Manufacturer: GENERIC; Manufacturer1 Part Number: 232270671003L; TC: ±100ppm/°C; Table: Resistors SMD; Part Number: R0402_10K_1%_0.0625W_100PPM; Component Kind: Standard; Component Type: Standard; Pin Count: 2; Value: 10k; Status: Not recommended; Power: 0.0625W; Tolerance: ±1%; Manufacturer Part Number: R0402_10K_1%_0.0625W_100PPM; Case: 0402; Mounted: Yes; Socket: No; SMD: Yes; Manufacturer1 Example: YAGEO PHYCOMP; Manufacturer1 ComponentHeight: 0.4mm; HelpURL: \\cern.ch\dfs\Applications\Altium\Datasheets\R0402_Phycomp_RC0402.pdf; Author: CERN DEM JLC; CreateDate: 2007-12-03; LatestRevisionDate: 2012-10-17
R556 = R0402_100K_1%_0.0625W_100PPM: Resistor - 1%; Part Description: General Purpose Thick Film Chip Resistor; Manufacturer: GENERIC; Manufacturer1 Part Number: 232270671004L; TC: ±100ppm/°C; Table: Resistors SMD; Part Number: R0402_100K_1%_0.0625W_100PPM; Component Kind: Standard; Component Type: Standard; Pin Count: 2; Value: 100k; Status: Not recommended; Power: 0.0625W; Tolerance: ±1%; Manufacturer Part Number: R0402_100K_1%_0.0625W_100PPM; Case: 0402; Mounted: Yes; Socket: No; SMD: Yes; Manufacturer1 Example: YAGEO PHYCOMP; Manufacturer1 ComponentHeight: 0.4mm; HelpURL: \\cern.ch\dfs\Applications\Altium\Datasheets\R0402_Phycomp_RC0402.pdf; Author: CERN DEM JLC; CreateDate: 2007-12-03; LatestRevisionDate: 2012-10-17
T1 T2 T7 T8 = BSS138LT1G: N-CHANNEL MOSFET WITH DIODE; Manufacturer: ON SEMICONDUCTOR; Part Description: 50V 200mA N-Channel Enhancement Mode Field-Effect Transistor; PressFit: No; Bonding: No; Manufacturer Part Number: BSS138LT1G; PackageDescription: SOT23 3-Leads, Pitch 0.95mm - Body 1.4x3mm, IPC Medium Density; Part Number: BSS138LT1G; Component Kind: Standard; Component Type: Standard; Device: BSS138LT1G; Pin Count: 3; Case: SOT23-3; Mounted: Yes; Socket: No; SMD: Yes; Sense: No; ComponentHeight: 1.11mm; HelpURL: \\cern.ch\dfs\Applications\Altium\Datasheets\BSS138LT1G.pdf; Author: CERN DEM JLC; CreateDate: 23.03.2009; LatestRevisionDate: 23.03.2009

## Sheet RTM_CON.SchDoc: AMC FMC Carrier v4
size 420 x 297 mm; CompanyName: WUT; Organization: WUT ISE; Address1: Warsaw University of Technology; Address2: Nowowiejska 15/19 00-665 Warsaw; Address3: t.przywozki@gmail.com; Revision: 1; SheetNumber: 20; SheetTotal: 29; Project: AMC FMC Carrier v4.0.2; ModifiedBy: F. Świtakowski; CheckedDate: -; Title2: RTM Connector; DivGrp: ISE; Designer: T. Przywozki; ModifiedDate: -; ProjectName: ADC/DAC MEZZANINE
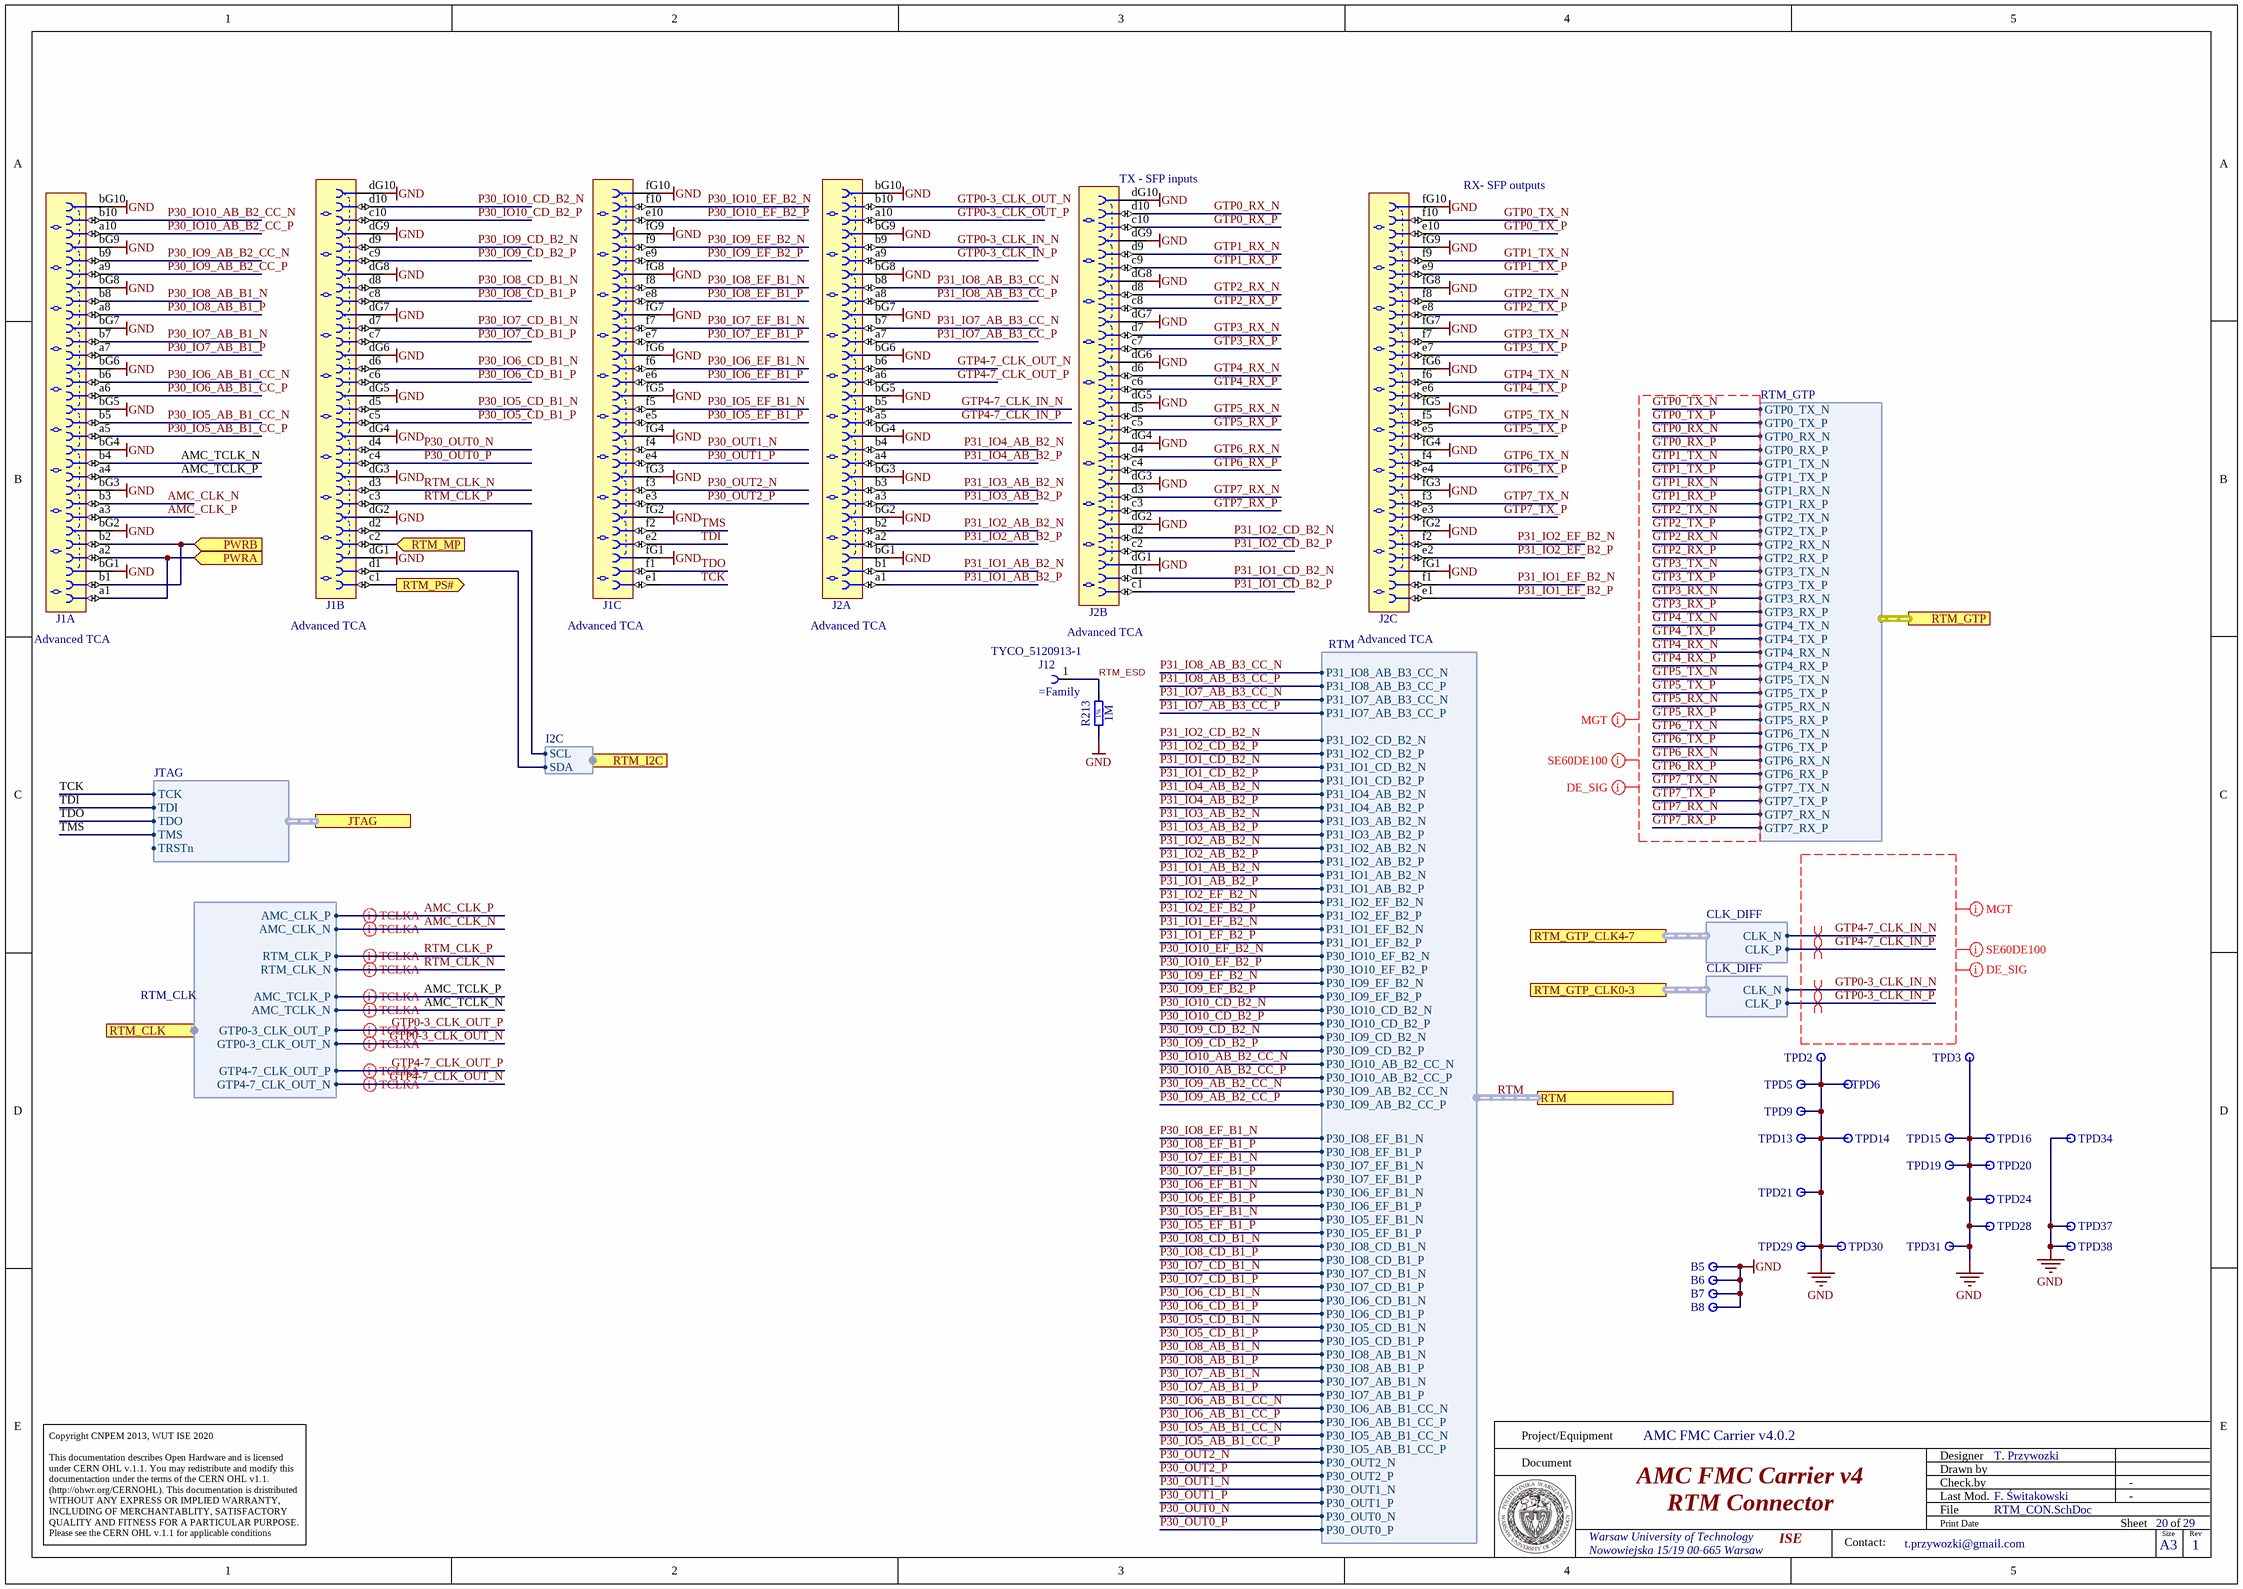
[diagram p21: RTM_CON.SchDoc]

### Parts
B5  Test Point  [VERO_20-2136]  (value not drawn)  (no BOM)
B6  Test Point  [VERO_20-2136]  (value not drawn)  (no BOM)
B7  Test Point  [VERO_20-2136]  (value not drawn)  (no BOM)
B8  Test Point  [VERO_20-2136]  (value not drawn)  (no BOM)
J1  Advanced TCA  [TYCO_6469081-1]  (parts A,B,C of 3)
J2  Advanced TCA  [TYCO_6469081-1]  (parts A,B,C of 3)
J12  (no value)  [TYCO_5120913-1]
R213  1M  [RESC5025X65N]
TPD2  (no value)  [TYCO_RCT-0C]
TPD3  (no value)  [TYCO_RCT-0C]
TPD5  (no value)  [TYCO_RCT-0C]
TPD6  (no value)  [TYCO_RCT-0C]
TPD9  (no value)  [TYCO_RCT-0C]
TPD13  (no value)  [TYCO_RCT-0C]
TPD14  (no value)  [TYCO_RCT-0C]
TPD15  (no value)  [TYCO_RCT-0C]
TPD16  (no value)  [TYCO_RCT-0C]
TPD19  (no value)  [TYCO_RCT-0C]
TPD20  (no value)  [TYCO_RCT-0C]
TPD21  (no value)  [TYCO_RCT-0C]
TPD24  (no value)  [TYCO_RCT-0C]
TPD28  (no value)  [TYCO_RCT-0C]
TPD29  (no value)  [TYCO_RCT-0C]
TPD30  (no value)  [TYCO_RCT-0C]
TPD31  (no value)  [TYCO_RCT-0C]
TPD34  (no value)  [TYCO_RCT-0C]
TPD37  (no value)  [TYCO_RCT-0C]
TPD38  (no value)  [TYCO_RCT-0C]

### Ports
JTAG (harness JTAG), PWRA (in), PWRB (in), RTM (harness RTM), RTM_CLK (harness RTM_CLK), RTM_GTP (harness RTM_GTP), RTM_GTP_CLK0-3 (harness CLK_DIFF), RTM_GTP_CLK4-7 (harness CLK_DIFF), RTM_I2C (harness I2C), RTM_MP (in), RTM_PS# (out)

### Harnesses
RTM_GTP: GTP0_RX_N, GTP0_RX_P, GTP0_TX_N, GTP0_TX_P, GTP1_TX_N, GTP1_TX_P, GTP1_RX_N, GTP1_RX_P, GTP2_TX_N, GTP2_TX_P, GTP2_RX_N, GTP2_RX_P, GTP3_TX_N, GTP3_TX_P, GTP3_RX_N, GTP3_RX_P, GTP4_TX_N, GTP4_TX_P, GTP4_RX_N, GTP4_RX_P, GTP5_TX_N, GTP5_TX_P, GTP5_RX_N, GTP5_RX_P, GTP6_TX_N, GTP6_TX_P, GTP6_RX_N, GTP6_RX_P, GTP7_TX_N, GTP7_TX_P, GTP7_RX_N, GTP7_RX_P
JTAG: TCK, TDI, TDO, TMS, TRSTn
CLK_DIFF: CLK_P, CLK_N
RTM_CLK: GTP0-3_CLK_OUT_P, GTP0-3_CLK_OUT_N, GTP4-7_CLK_OUT_P, GTP4-7_CLK_OUT_N, AMC_TCLK_P, AMC_TCLK_N, RTM_CLK_P, RTM_CLK_N, AMC_CLK_P, AMC_CLK_N
RTM: P31_IO2_CD_B2_N, P31_IO2_CD_B2_P, P31_IO8_AB_B3_CC_N, P31_IO1_CD_B2_N, P31_IO8_AB_B3_CC_P, P31_IO1_CD_B2_P, P31_IO7_AB_B3_CC_N, P31_IO4_AB_B2_N, P31_IO7_AB_B3_CC_P, P31_IO4_AB_B2_P, P30_IO9_AB_B2_CC_P, P30_IO10_CD_B2_P, P30_IO9_CD_B2_N, P30_IO9_CD_B2_P, P30_IO10_AB_B2_CC_N, P30_IO8_EF_B1_N, P30_IO10_AB_B2_CC_P, P30_IO8_EF_B1_P, P30_IO9_AB_B2_CC_N, P30_IO7_EF_B1_N, P30_OUT2_P, P30_OUT2_N, P30_OUT1_N, P30_IO5_AB_B1_CC_P, P30_OUT1_P, P30_IO5_AB_B1_CC_N, P30_OUT0_N, P30_IO6_AB_B1_CC_P, P30_OUT0_P, P30_IO7_CD_B1_P, P30_IO6_CD_B1_N, P30_IO7_EF_B1_P, P30_IO6_CD_B1_P, P30_IO6_EF_B1_N, P30_IO5_CD_B1_N, P30_IO6_EF_B1_P, P30_IO5_CD_B1_P, P30_IO5_EF_B1_N, P30_IO8_AB_B1_N, P30_IO5_EF_B1_P, P30_IO8_AB_B1_P, P30_IO8_CD_B1_N, P30_IO7_AB_B1_N, P30_IO8_CD_B1_P, P30_IO7_AB_B1_P, P30_IO7_CD_B1_N, P30_IO6_AB_B1_CC_N, P31_IO3_AB_B2_N, P31_IO3_AB_B2_P, P31_IO2_AB_B2_N, P31_IO2_AB_B2_P, P31_IO1_AB_B2_N, P31_IO1_AB_B2_P, P31_IO2_EF_B2_N, P31_IO2_EF_B2_P, P31_IO1_EF_B2_N, P31_IO1_EF_B2_P, P30_IO10_EF_B2_N, P30_IO10_EF_B2_P, P30_IO9_EF_B2_N, P30_IO9_EF_B2_P, P30_IO10_CD_B2_N
I2C: SCL, SDA

### Nets
GND: B5.1 B6.1 B7.1 B8.1 J1.bG1 J1.bG2 J1.bG3 J1.bG4 J1.bG5 J1.bG6 J1.bG7 J1.bG8 J1.bG9 J1.bG10 J1.dG1 J1.dG2 J1.dG3 J1.dG4 J1.dG5 J1.dG6 J1.dG7 J1.dG8 J1.dG9 J1.dG10 J1.fG1 J1.fG2 J1.fG3 J1.fG4 J1.fG5 J1.fG6 J1.fG7 J1.fG8 J1.fG9 J1.fG10 J2.bG1 J2.bG2 J2.bG3 J2.bG4 J2.bG5 J2.bG6 J2.bG7 J2.bG8 J2.bG9 J2.bG10 J2.dG1 J2.dG2 J2.dG3 J2.dG4 J2.dG5 J2.dG6 J2.dG7 J2.dG8 J2.dG9 J2.dG10 J2.fG1 J2.fG2 J2.fG3 J2.fG4 J2.fG5 J2.fG6 J2.fG7 J2.fG8 J2.fG9 J2.fG10 R213.1 TPD2.1 TPD3.1 TPD5.1 TPD6.1 TPD9.1 TPD13.1 TPD14.1 TPD15.1 TPD16.1 TPD19.1 TPD20.1 TPD21.1 TPD24.1 TPD28.1 TPD29.1 TPD30.1 TPD31.1 TPD34.1 TPD37.1 TPD38.1
AMC_CLK_N: J1.b3 ; port RTM_CLK.AMC_CLK_N
AMC_CLK_P: J1.a3 ; port RTM_CLK.AMC_CLK_P
AMC_TCLK_N: J1.b4 ; port RTM_CLK.AMC_TCLK_N
AMC_TCLK_P: J1.a4 ; port RTM_CLK.AMC_TCLK_P
GTP0-3_CLK_IN_N: J2.b9 ; port RTM_GTP_CLK0-3.CLK_N
GTP0-3_CLK_IN_P: J2.a9 ; port RTM_GTP_CLK0-3.CLK_P
GTP0-3_CLK_OUT_N: J2.b10 ; port RTM_CLK.GTP0-3_CLK_OUT_N
GTP0-3_CLK_OUT_P: J2.a10 ; port RTM_CLK.GTP0-3_CLK_OUT_P
GTP0_RX_N: J2.d10 ; port RTM_GTP.GTP0_RX_N
GTP0_RX_P: J2.c10 ; port RTM_GTP.GTP0_RX_P
GTP0_TX_N: J2.f10 ; port RTM_GTP.GTP0_TX_N
GTP0_TX_P: J2.e10 ; port RTM_GTP.GTP0_TX_P
GTP1_RX_N: J2.d9 ; port RTM_GTP.GTP1_RX_N
GTP1_RX_P: J2.c9 ; port RTM_GTP.GTP1_RX_P
GTP1_TX_N: J2.f9 ; port RTM_GTP.GTP1_TX_N
GTP1_TX_P: J2.e9 ; port RTM_GTP.GTP1_TX_P
GTP2_RX_N: J2.d8 ; port RTM_GTP.GTP2_RX_N
GTP2_RX_P: J2.c8 ; port RTM_GTP.GTP2_RX_P
GTP2_TX_N: J2.f8 ; port RTM_GTP.GTP2_TX_N
GTP2_TX_P: J2.e8 ; port RTM_GTP.GTP2_TX_P
GTP3_RX_N: J2.d7 ; port RTM_GTP.GTP3_RX_N
GTP3_RX_P: J2.c7 ; port RTM_GTP.GTP3_RX_P
GTP3_TX_N: J2.f7 ; port RTM_GTP.GTP3_TX_N
GTP3_TX_P: J2.e7 ; port RTM_GTP.GTP3_TX_P
GTP4-7_CLK_IN_N: J2.b5 ; port RTM_GTP_CLK4-7.CLK_N
GTP4-7_CLK_IN_P: J2.a5 ; port RTM_GTP_CLK4-7.CLK_P
GTP4-7_CLK_OUT_N: J2.b6 ; port RTM_CLK.GTP4-7_CLK_OUT_N
GTP4-7_CLK_OUT_P: J2.a6 ; port RTM_CLK.GTP4-7_CLK_OUT_P
GTP4_RX_N: J2.d6 ; port RTM_GTP.GTP4_RX_N
GTP4_RX_P: J2.c6 ; port RTM_GTP.GTP4_RX_P
GTP4_TX_N: J2.f6 ; port RTM_GTP.GTP4_TX_N
GTP4_TX_P: J2.e6 ; port RTM_GTP.GTP4_TX_P
GTP5_RX_N: J2.d5 ; port RTM_GTP.GTP5_RX_N
GTP5_RX_P: J2.c5 ; port RTM_GTP.GTP5_RX_P
GTP5_TX_N: J2.f5 ; port RTM_GTP.GTP5_TX_N
GTP5_TX_P: J2.e5 ; port RTM_GTP.GTP5_TX_P
GTP6_RX_N: J2.d4 ; port RTM_GTP.GTP6_RX_N
GTP6_RX_P: J2.c4 ; port RTM_GTP.GTP6_RX_P
GTP6_TX_N: J2.f4 ; port RTM_GTP.GTP6_TX_N
GTP6_TX_P: J2.e4 ; port RTM_GTP.GTP6_TX_P
GTP7_RX_N: J2.d3 ; port RTM_GTP.GTP7_RX_N
GTP7_RX_P: J2.c3 ; port RTM_GTP.GTP7_RX_P
GTP7_TX_N: J2.f3 ; port RTM_GTP.GTP7_TX_N
GTP7_TX_P: J2.e3 ; port RTM_GTP.GTP7_TX_P
P30_IO5_AB_B1_CC_N: J1.b5 ; port RTM.P30_IO5_AB_B1_CC_N  [project net RTM.P30_IO5_AB_B1_CC_N]
P30_IO5_AB_B1_CC_P: J1.a5 ; port RTM.P30_IO5_AB_B1_CC_P  [project net RTM.P30_IO5_AB_B1_CC_P]
P30_IO5_CD_B1_N: J1.d5 ; port RTM.P30_IO5_CD_B1_N  [project net RTM.P30_IO5_CD_B1_N]
P30_IO5_CD_B1_P: J1.c5 ; port RTM.P30_IO5_CD_B1_P  [project net RTM.P30_IO5_CD_B1_P]
P30_IO5_EF_B1_N: J1.f5 ; port RTM.P30_IO5_EF_B1_N  [project net RTM.P30_IO5_EF_B1_N]
P30_IO5_EF_B1_P: J1.e5 ; port RTM.P30_IO5_EF_B1_P  [project net RTM.P30_IO5_EF_B1_P]
P30_IO6_AB_B1_CC_N: J1.b6 ; port RTM.P30_IO6_AB_B1_CC_N  [project net RTM.P30_IO6_AB_B1_CC_N]
P30_IO6_AB_B1_CC_P: J1.a6 ; port RTM.P30_IO6_AB_B1_CC_P  [project net RTM.P30_IO6_AB_B1_CC_P]
P30_IO6_CD_B1_N: J1.d6 ; port RTM.P30_IO6_CD_B1_N  [project net RTM.P30_IO6_CD_B1_N]
P30_IO6_CD_B1_P: J1.c6 ; port RTM.P30_IO6_CD_B1_P  [project net RTM.P30_IO6_CD_B1_P]
P30_IO6_EF_B1_N: J1.f6 ; port RTM.P30_IO6_EF_B1_N  [project net RTM.P30_IO6_EF_B1_N]
P30_IO6_EF_B1_P: J1.e6 ; port RTM.P30_IO6_EF_B1_P  [project net RTM.P30_IO6_EF_B1_P]
P30_IO7_AB_B1_N: J1.b7 ; port RTM.P30_IO7_AB_B1_N  [project net RTM.P30_IO7_AB_B1_N]
P30_IO7_AB_B1_P: J1.a7 ; port RTM.P30_IO7_AB_B1_P  [project net RTM.P30_IO7_AB_B1_P]
P30_IO7_CD_B1_N: J1.d7 ; port RTM.P30_IO7_CD_B1_N  [project net RTM.P30_IO7_CD_B1_N]
P30_IO7_CD_B1_P: J1.c7 ; port RTM.P30_IO7_CD_B1_P  [project net RTM.P30_IO7_CD_B1_P]
P30_IO7_EF_B1_N: J1.f7 ; port RTM.P30_IO7_EF_B1_N  [project net RTM.P30_IO7_EF_B1_N]
P30_IO7_EF_B1_P: J1.e7 ; port RTM.P30_IO7_EF_B1_P  [project net RTM.P30_IO7_EF_B1_P]
P30_IO8_AB_B1_N: J1.b8 ; port RTM.P30_IO8_AB_B1_N  [project net RTM.P30_IO8_AB_B1_N]
P30_IO8_AB_B1_P: J1.a8 ; port RTM.P30_IO8_AB_B1_P  [project net RTM.P30_IO8_AB_B1_P]
P30_IO8_CD_B1_N: J1.d8 ; port RTM.P30_IO8_CD_B1_N  [project net RTM.P30_IO8_CD_B1_N]
P30_IO8_CD_B1_P: J1.c8 ; port RTM.P30_IO8_CD_B1_P  [project net RTM.P30_IO8_CD_B1_P]
P30_IO8_EF_B1_N: J1.f8 ; port RTM.P30_IO8_EF_B1_N  [project net RTM.P30_IO8_EF_B1_N]
P30_IO8_EF_B1_P: J1.e8 ; port RTM.P30_IO8_EF_B1_P  [project net RTM.P30_IO8_EF_B1_P]
P30_IO9_AB_B2_CC_N: J1.b9 ; port RTM.P30_IO9_AB_B2_CC_N  [project net RTM.P30_IO9_AB_B2_CC_N]
P30_IO9_AB_B2_CC_P: J1.a9 ; port RTM.P30_IO9_AB_B2_CC_P  [project net RTM.P30_IO9_AB_B2_CC_P]
P30_IO9_CD_B2_N: J1.d9 ; port RTM.P30_IO9_CD_B2_N  [project net RTM.P30_IO9_CD_B2_N]
P30_IO9_CD_B2_P: J1.c9 ; port RTM.P30_IO9_CD_B2_P  [project net RTM.P30_IO9_CD_B2_P]
P30_IO9_EF_B2_N: J1.f9 ; port RTM.P30_IO9_EF_B2_N  [project net RTM.P30_IO9_EF_B2_N]
P30_IO9_EF_B2_P: J1.e9 ; port RTM.P30_IO9_EF_B2_P  [project net RTM.P30_IO9_EF_B2_P]
P30_IO10_AB_B2_CC_N: J1.b10 ; port RTM.P30_IO10_AB_B2_CC_N  [project net RTM.P30_IO10_AB_B2_CC_N]
P30_IO10_AB_B2_CC_P: J1.a10 ; port RTM.P30_IO10_AB_B2_CC_P  [project net RTM.P30_IO10_AB_B2_CC_P]
P30_IO10_CD_B2_N: J1.d10 ; port RTM.P30_IO10_CD_B2_N  [project net RTM.P30_IO10_CD_B2_N]
P30_IO10_CD_B2_P: J1.c10 ; port RTM.P30_IO10_CD_B2_P  [project net RTM.P30_IO10_CD_B2_P]
P30_IO10_EF_B2_N: J1.f10 ; port RTM.P30_IO10_EF_B2_N  [project net RTM.P30_IO10_EF_B2_N]
P30_IO10_EF_B2_P: J1.e10 ; port RTM.P30_IO10_EF_B2_P  [project net RTM.P30_IO10_EF_B2_P]
P30_OUT0_N: J1.d4 ; port RTM.P30_OUT0_N  [project net RTM.P30_OUT0_N]
P30_OUT0_P: J1.c4 ; port RTM.P30_OUT0_P  [project net RTM.P30_OUT0_P]
P30_OUT1_N: J1.f4 ; port RTM.P30_OUT1_N  [project net RTM.P30_OUT1_N]
P30_OUT1_P: J1.e4 ; port RTM.P30_OUT1_P  [project net RTM.P30_OUT1_P]
P30_OUT2_N: J1.f3 ; port RTM.P30_OUT2_N  [project net RTM.P30_OUT2_N]
P30_OUT2_P: J1.e3 ; port RTM.P30_OUT2_P  [project net RTM.P30_OUT2_P]
P31_IO1_AB_B2_N: J2.b1 ; port RTM.P31_IO1_AB_B2_N  [project net RTM.P31_IO1_AB_B2_N]
P31_IO1_AB_B2_P: J2.a1 ; port RTM.P31_IO1_AB_B2_P  [project net RTM.P31_IO1_AB_B2_P]
P31_IO1_CD_B2_N: J2.d1 ; port RTM.P31_IO1_CD_B2_N  [project net RTM.P31_IO1_CD_B2_N]
P31_IO1_CD_B2_P: J2.c1 ; port RTM.P31_IO1_CD_B2_P  [project net RTM.P31_IO1_CD_B2_P]
P31_IO1_EF_B2_N: J2.f1 ; port RTM.P31_IO1_EF_B2_N  [project net RTM.P31_IO1_EF_B2_N]
P31_IO1_EF_B2_P: J2.e1 ; port RTM.P31_IO1_EF_B2_P  [project net RTM.P31_IO1_EF_B2_P]
P31_IO2_AB_B2_N: J2.b2 ; port RTM.P31_IO2_AB_B2_N  [project net RTM.P31_IO2_AB_B2_N]
P31_IO2_AB_B2_P: J2.a2 ; port RTM.P31_IO2_AB_B2_P  [project net RTM.P31_IO2_AB_B2_P]
P31_IO2_CD_B2_N: J2.d2 ; port RTM.P31_IO2_CD_B2_N  [project net RTM.P31_IO2_CD_B2_N]
P31_IO2_CD_B2_P: J2.c2 ; port RTM.P31_IO2_CD_B2_P  [project net RTM.P31_IO2_CD_B2_P]
P31_IO2_EF_B2_N: J2.f2 ; port RTM.P31_IO2_EF_B2_N  [project net RTM.P31_IO2_EF_B2_N]
P31_IO2_EF_B2_P: J2.e2 ; port RTM.P31_IO2_EF_B2_P  [project net RTM.P31_IO2_EF_B2_P]
P31_IO3_AB_B2_N: J2.b3 ; port RTM.P31_IO3_AB_B2_N  [project net RTM.P31_IO3_AB_B2_N]
P31_IO3_AB_B2_P: J2.a3 ; port RTM.P31_IO3_AB_B2_P  [project net RTM.P31_IO3_AB_B2_P]
P31_IO4_AB_B2_N: J2.b4 ; port RTM.P31_IO4_AB_B2_N  [project net RTM.P31_IO4_AB_B2_N]
P31_IO4_AB_B2_P: J2.a4 ; port RTM.P31_IO4_AB_B2_P  [project net RTM.P31_IO4_AB_B2_P]
P31_IO7_AB_B3_CC_N: J2.b7 ; port RTM.P31_IO7_AB_B3_CC_N  [project net RTM.P31_IO7_AB_B3_CC_N]
P31_IO7_AB_B3_CC_P: J2.a7 ; port RTM.P31_IO7_AB_B3_CC_P  [project net RTM.P31_IO7_AB_B3_CC_P]
P31_IO8_AB_B3_CC_N: J2.b8 ; port RTM.P31_IO8_AB_B3_CC_N  [project net RTM.P31_IO8_AB_B3_CC_N]
P31_IO8_AB_B3_CC_P: J2.a8 ; port RTM.P31_IO8_AB_B3_CC_P  [project net RTM.P31_IO8_AB_B3_CC_P]
PWRA: J1.a1 J1.a2 J1.b1 J1.b2 ; port PWRA, port PWRB
RTM_CLK_N: J1.d3 ; port RTM_CLK.RTM_CLK_N
RTM_CLK_P: J1.c3 ; port RTM_CLK.RTM_CLK_P
RTM_ESD: J12.1 R213.2
RTM_MP: J1.c2 ; port RTM_MP
RTM_PS#: J1.c1 ; port RTM_PS#
SCL5: J1.d2 ; port RTM_I2C.SCL
SDA5: J1.d1 ; port RTM_I2C.SDA
TCK: J1.e1 ; port JTAG.TCK  [project net RTM_TCK]
TDI: J1.e2 ; port JTAG.TDI  [project net RTM_TDI]
TDO: J1.f1 ; port JTAG.TDO  [project net RTM_TDO]
TMS: J1.f2 ; port JTAG.TMS  [project net RTM_TMS]

### Buses and harness runs
harness RTM = port RTM

### Layout directives
net class SE60DE100: GTP0-3_CLK_IN_N, GTP0-3_CLK_IN_P, GTP0_RX_N, GTP0_RX_P, GTP0_TX_N, GTP0_TX_P, GTP1_RX_N, GTP1_RX_P, GTP1_TX_N, GTP1_TX_P, GTP2_RX_N, GTP2_RX_P, GTP2_TX_N, GTP2_TX_P, GTP3_RX_N, GTP3_RX_P, GTP3_TX_N, GTP3_TX_P, GTP4-7_CLK_IN_N, GTP4-7_CLK_IN_P, GTP4_RX_N, GTP4_RX_P, GTP4_TX_N, GTP4_TX_P, GTP5_RX_N, GTP5_RX_P, GTP5_TX_N, GTP5_TX_P, GTP6_RX_N, GTP6_RX_P, GTP6_TX_N, GTP6_TX_P, GTP7_RX_N, GTP7_RX_P, GTP7_TX_N, GTP7_TX_P
net class DE_SIG: GTP0-3_CLK_IN_N, GTP0-3_CLK_IN_P, GTP0_RX_N, GTP0_RX_P, GTP0_TX_N, GTP0_TX_P, GTP1_RX_N, GTP1_RX_P, GTP1_TX_N, GTP1_TX_P, GTP2_RX_N, GTP2_RX_P, GTP2_TX_N, GTP2_TX_P, GTP3_RX_N, GTP3_RX_P, GTP3_TX_N, GTP3_TX_P, GTP4-7_CLK_IN_N, GTP4-7_CLK_IN_P, GTP4_RX_N, GTP4_RX_P, GTP4_TX_N, GTP4_TX_P, GTP5_RX_N, GTP5_RX_P, GTP5_TX_N, GTP5_TX_P, GTP6_RX_N, GTP6_RX_P, GTP6_TX_N, GTP6_TX_P, GTP7_RX_N, GTP7_RX_P, GTP7_TX_N, GTP7_TX_P
differential pair: AMC_CLK_N, AMC_CLK_P, AMC_TCLK_N, AMC_TCLK_P, GTP0-3_CLK_IN_N, GTP0-3_CLK_IN_P, GTP0-3_CLK_OUT_N, GTP0-3_CLK_OUT_P, GTP4-7_CLK_IN_N, GTP4-7_CLK_IN_P, GTP4-7_CLK_OUT_N, GTP4-7_CLK_OUT_P, RTM_CLK_N, RTM_CLK_P
net class MGT: GTP0-3_CLK_IN_N, GTP0-3_CLK_IN_P, GTP0_RX_N, GTP0_RX_P, GTP0_TX_N, GTP0_TX_P, GTP1_RX_N, GTP1_RX_P, GTP1_TX_N, GTP1_TX_P, GTP2_RX_N, GTP2_RX_P, GTP2_TX_N, GTP2_TX_P, GTP3_RX_N, GTP3_RX_P, GTP3_TX_N, GTP3_TX_P, GTP4-7_CLK_IN_N, GTP4-7_CLK_IN_P, GTP4_RX_N, GTP4_RX_P, GTP4_TX_N, GTP4_TX_P, GTP5_RX_N, GTP5_RX_P, GTP5_TX_N, GTP5_TX_P, GTP6_RX_N, GTP6_RX_P, GTP6_TX_N, GTP6_TX_P, GTP7_RX_N, GTP7_RX_P, GTP7_TX_N, GTP7_TX_P

### Notes on the sheet
- (near J2) TX - SFP inputs
- RX- SFP outputs
- Project/Equipment
- Document
- Designer
- Drawn by
- Check.by
- Copyright CNPEM 2013, WUT ISE 2020
  This documentation describes Open Hardware and is licensed under CERN OHL v.1.1. You may redistribute and modify this documentaction under the terms of the CERN OHL v1.1.
  (http://ohwr.org/CERNOHL). This documentation is dristributed WITHOUT ANY EXPRESS OR IMPLIED WARRANTY, INCLUDING OF MERCHANTABLITY, SATISFACTORY QUALITY AND FITNESS FOR A PARTICULAR PURPOSE. Please see the CERN OHL v.1.1 for applicable conditions
- File
- Last Mod.
- Print Date
- Sheet
- Size
- A3
- of
- Rev
- Contact:
- (in symbol R2010_1M_1%_0.5W_200PPM) 1%

### Library data of the parts
B5-B8 = VERO_20-2136: Single Terminal Socket; Part Description: Black Bead PCB Terminal Test Pin (1.32 mm hole); Manufacturer: VERO TECHNOLOGIES; Table: Miscellaneous; Part Number: VERO_20-2136; Component Type: Standard; Pin Count: 1; Family: Test Point; Mounted: Yes; Socket: No; SMD: No; Status: None; Manufacturer Part Number: 20-2136; ComponentHeight: 5.3mm; HelpURL: \\cern.ch\dfs\Applications\Altium\Datasheets\VERO_20-2136.pdf; Author: CERN DEM JLC; CreateDate: 21/07/2008; LatestRevisionDate: 21/07/2008
J1 J2 = TYCO_6469081-1: Connector 60 ATCA Female 30 Pairs (60 Signals) + 3x10 Ground; Part Description: 60 Positions, Pitch 2.5mm,  Advanced TCA, Z-PACK HM-Zd Right Angle Press Fit Receptacle; Manufacturer: TYCO ELECTRONICS; Table: TYCO; Part Number: TYCO_6469081-1; Component Kind: Standard; Component Type: Standard; Pin Count: 90; Family: Advanced TCA; Mounted: Yes; Socket: No; SMD: No; Status: None; Manufacturer Part Number: 6469081-1; ComponentHeight: 12.18mm; HelpURL: \\cern.ch\dfs\Applications\Altium\Datasheets\TYCO_6469081-1.pdf; Author: CERN DEM JLC; CreateDate: 2013-08-28; LatestRevisionDate: 2013-08-28
J12 = TYCO_5120913-1: Single Pin Female; Manufacturer: TYCO ELECTRONICS; Part Description: Universal Right Angle Female Power Module Guide (keyed); PressFit: No; Manufacturer Part Number: 5120913-1; Part Number: TYCO_5120913-1; Component Kind: Standard; Component Type: Standard; Pin Count: 1; Mounted: Yes; Socket: No; SMD: No; Sense: No; Status: None; ComponentHeight: 9.78mm; HelpURL: \\cern.ch\dfs\Applications\Altium\Datasheets\TYCO_5120913-1.pdf; Author: CERN DEM JLC; CreateDate: 28.08.2013; LatestRevisionDate: 28.08.2013
R213 = R2010_1M_1%_0.5W_200PPM: Resistor - 1%; Manufacturer: GENERIC; Part Description: Thick Film Chip Resistor; Manufacturer1 Part Number: LHVC2010-1MFT4; Power: 0.5W; TC: ±200ppm/°C; PressFit: No; Manufacturer Part Number: R2010_1M_1%_0.5W_200PPM; Part Number: R2010_1M_1%_0.5W_200PPM; Tolerance: ±1%; Value: 1M; Component Kind: Standard; Component Type: Standard; Pin Count: 2; Status: None; Case: 2010; Mounted: Yes; Sense: No; Socket: No; SMD: Yes; Manufacturer1 Example: TT WELWYN; Manufacturer1 ComponentHeight: 0.65mm; HelpURL: \\cern.ch\dfs\Applications\Altium\Datasheets\R2010_WELWYN_LHVC.pdf; Author: CERN DEM JLC; CreateDate: 26.02.2015; LatestRevisionDate: 26.02.2015
TPD2 TPD3 TPD5 TPD6 TPD9 TPD13-TPD16 TPD19-TPD21 TPD24 TPD28-TPD31 TPD34 TPD37 TPD38 = TYCO_RCT-0C: Test Point; Part Description: 0805 (2012) Surface Mount Test Point; Manufacturer: TYCO ELECTRONICS; Manufacturer Part Number: RCT-0C; PressFit: No; Part Number: TYCO_RCT-0C; Component Kind: Standard; Component Type: Standard; Pin Count: 1; Mounted: Yes; Socket: No; SMD: Yes; Sense: No; Status: None; ComponentHeight: 1.45mm; HelpURL: \\cern.ch\dfs\Applications\Altium\Datasheets\TYCO_RCT-0C.pdf; Author: CERN DEM JLC; CreateDate: 07.05.2014; LatestRevisionDate: 07.05.2014